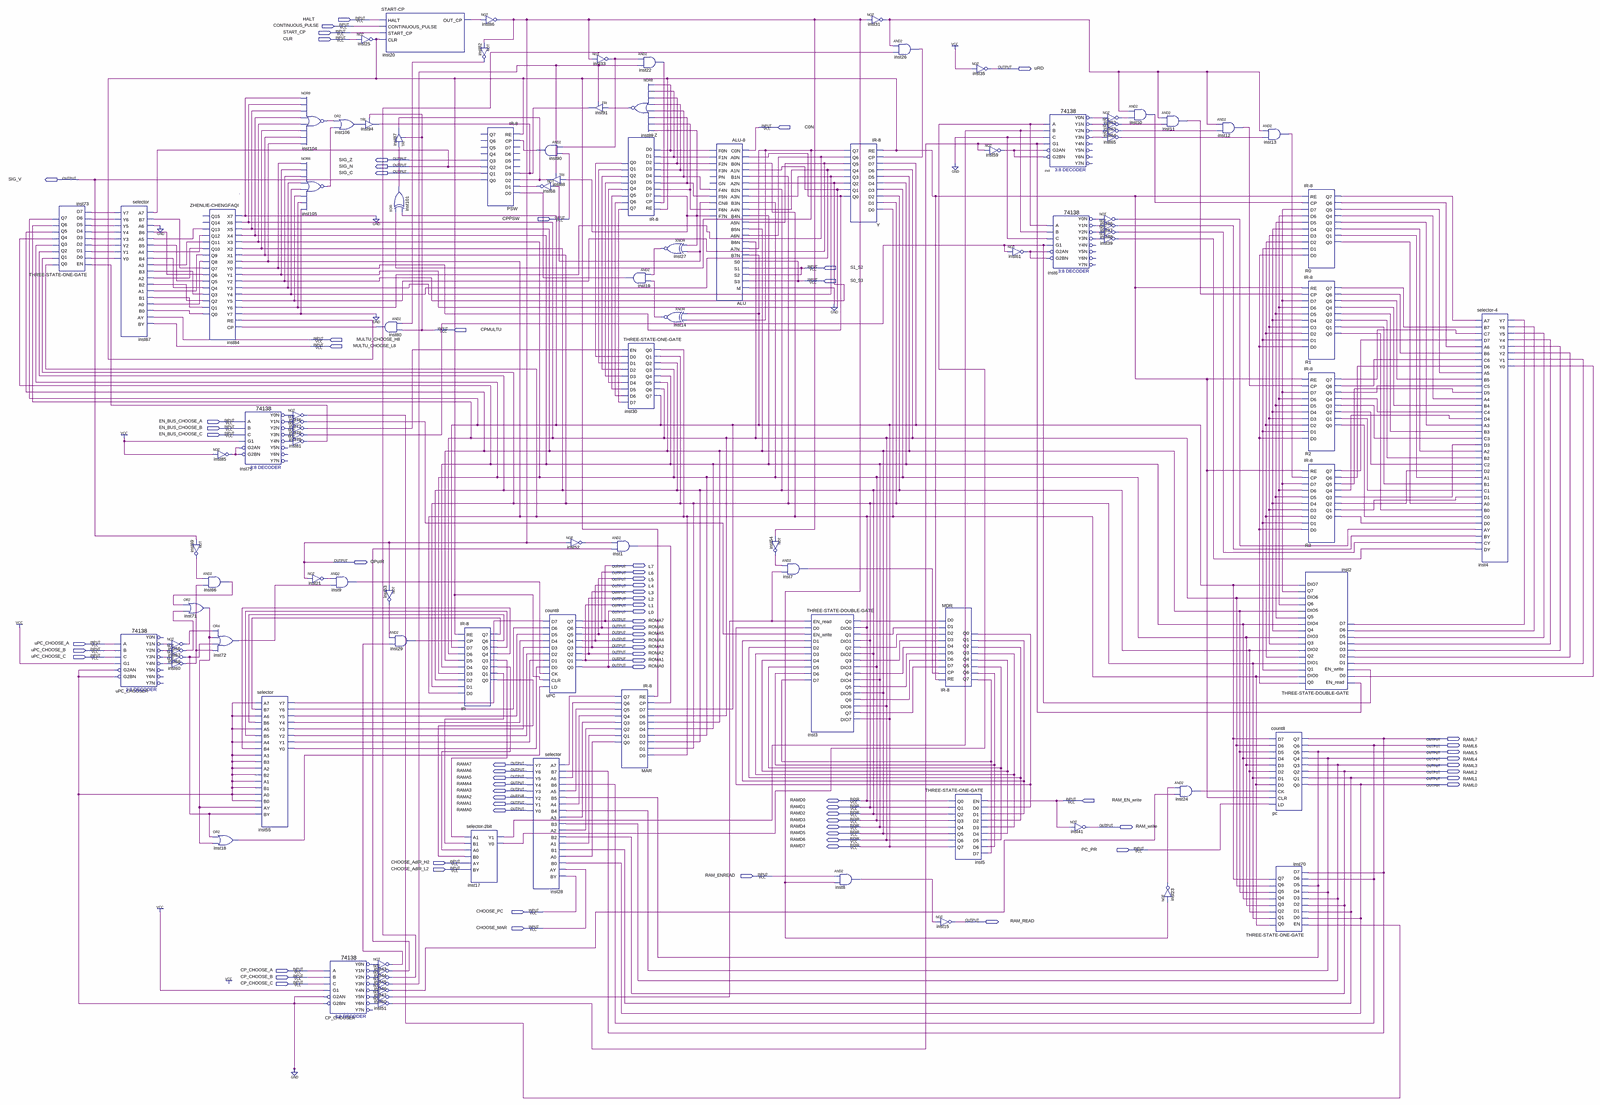
[diagram p0: schematic sheet, whole]
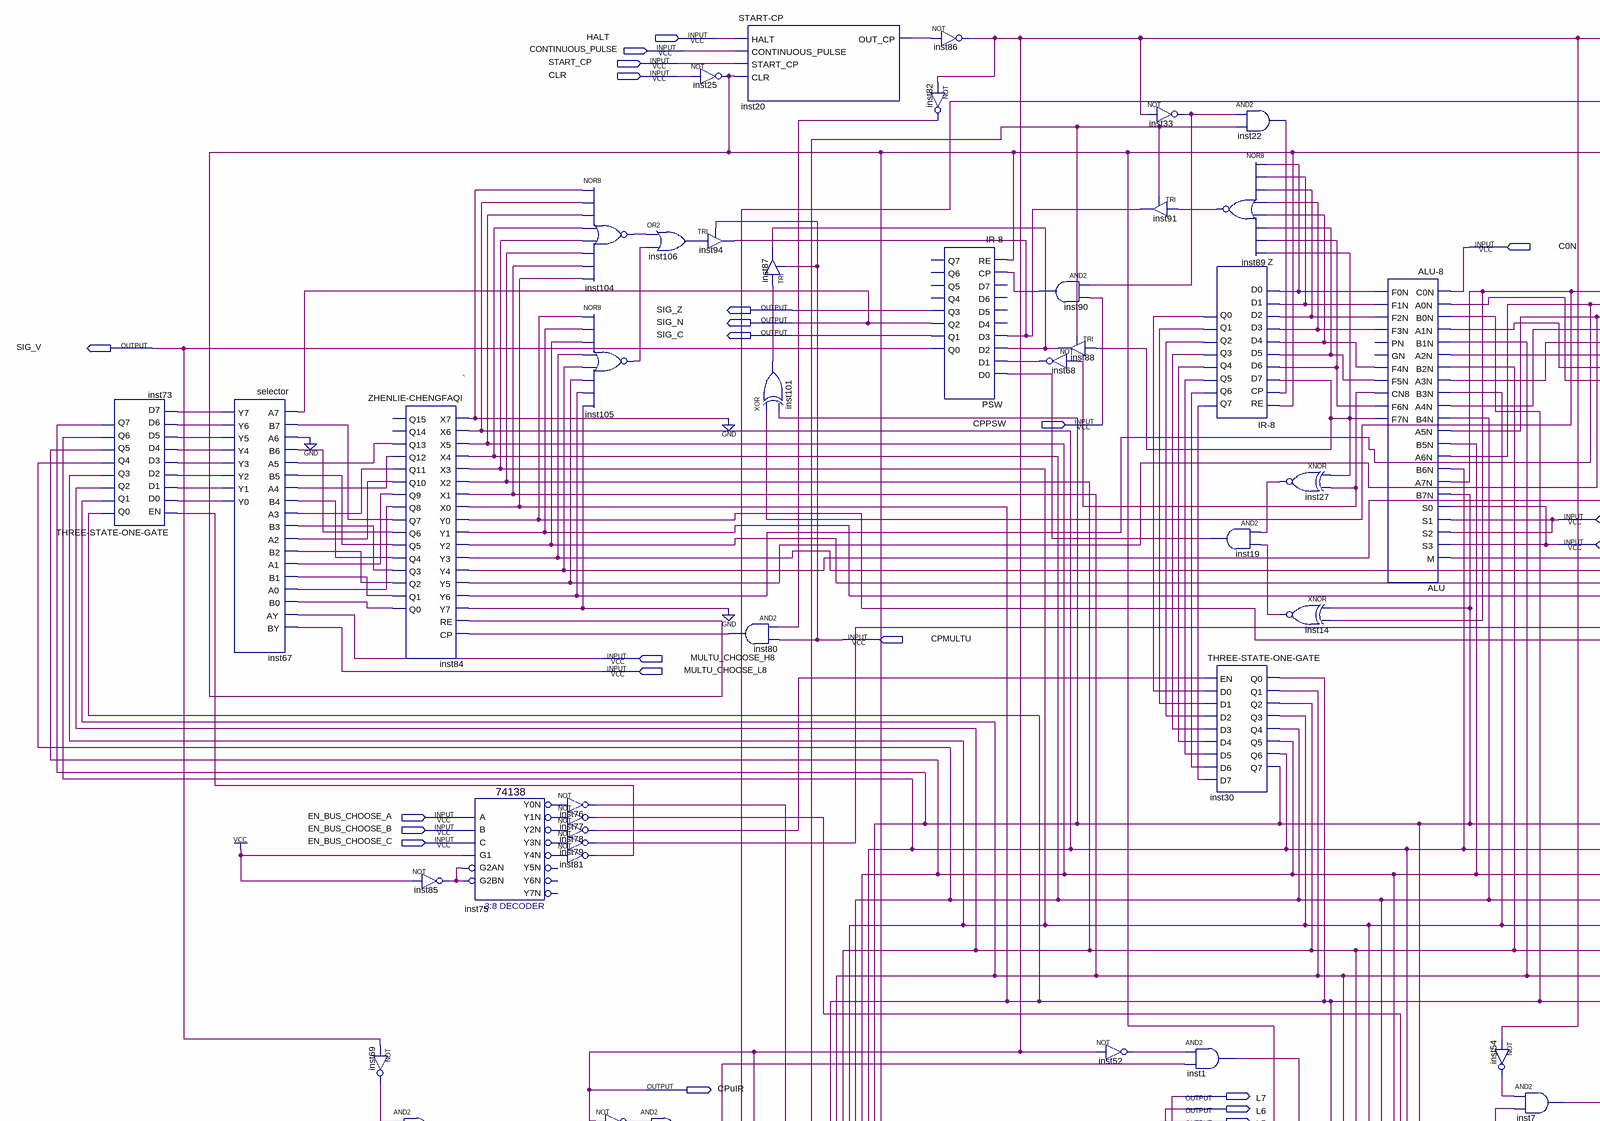
[diagram p1: schematic sheet, upper left part]
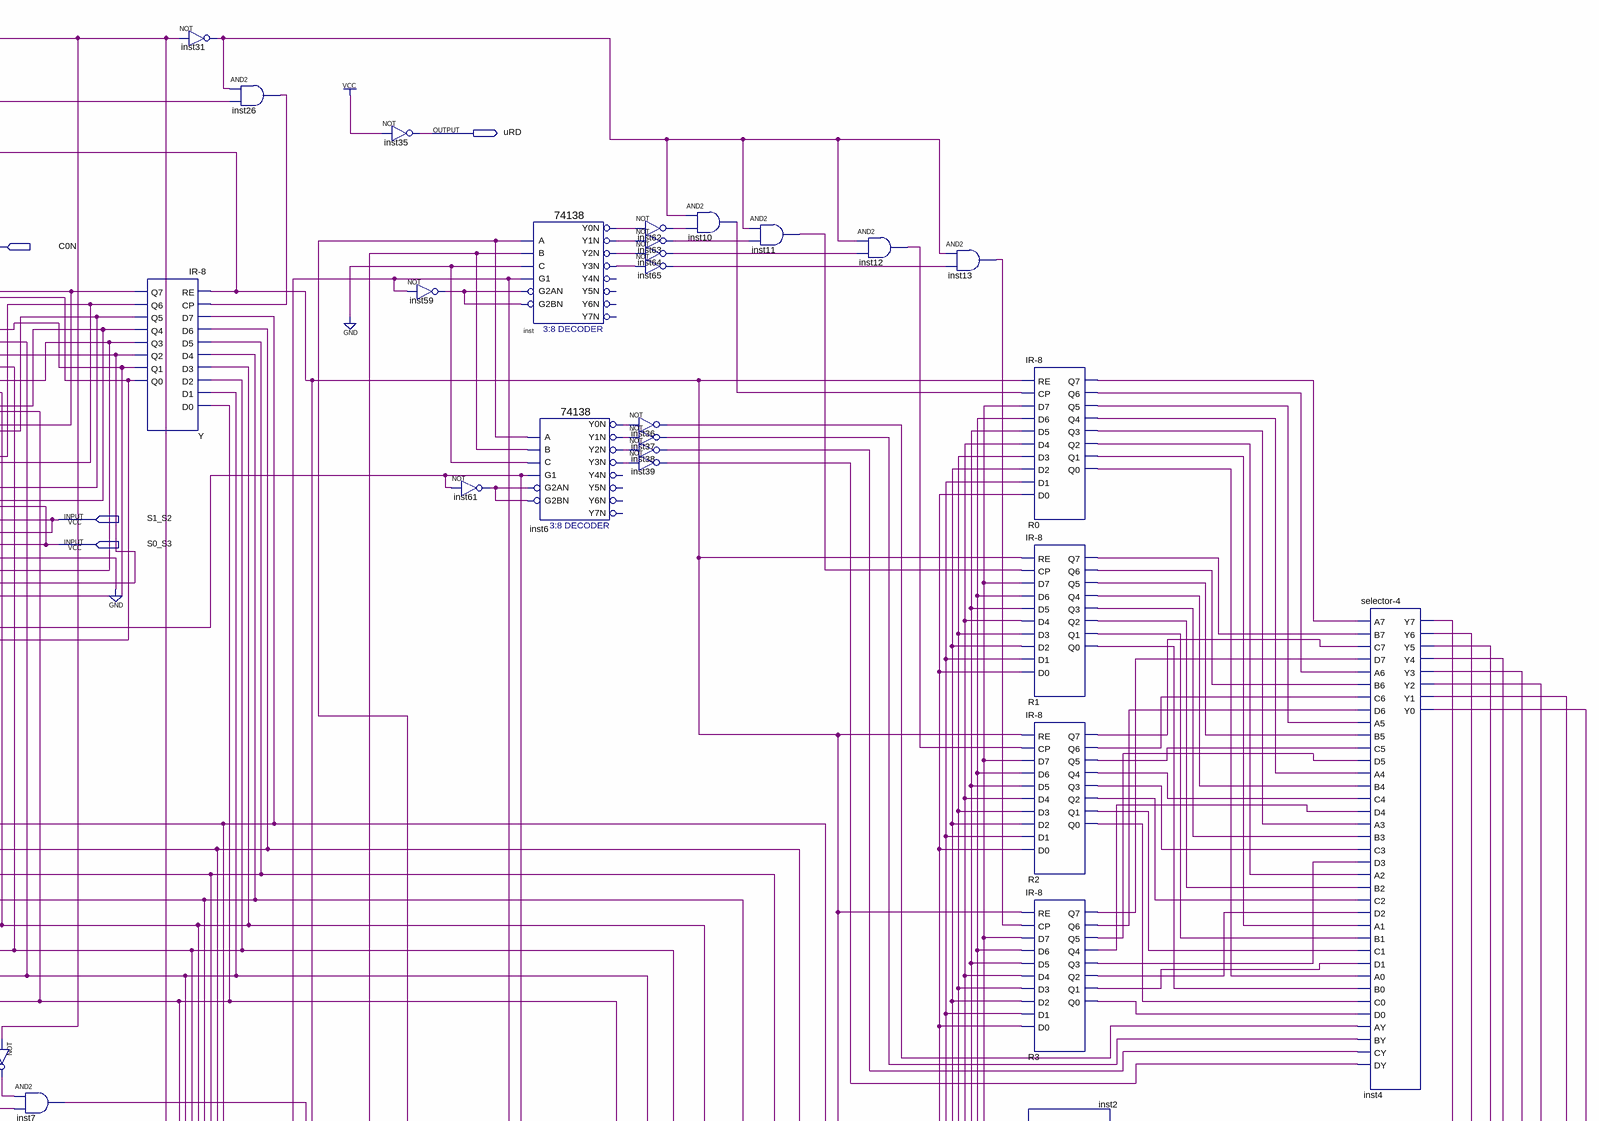
[diagram p2: schematic sheet, upper right part]
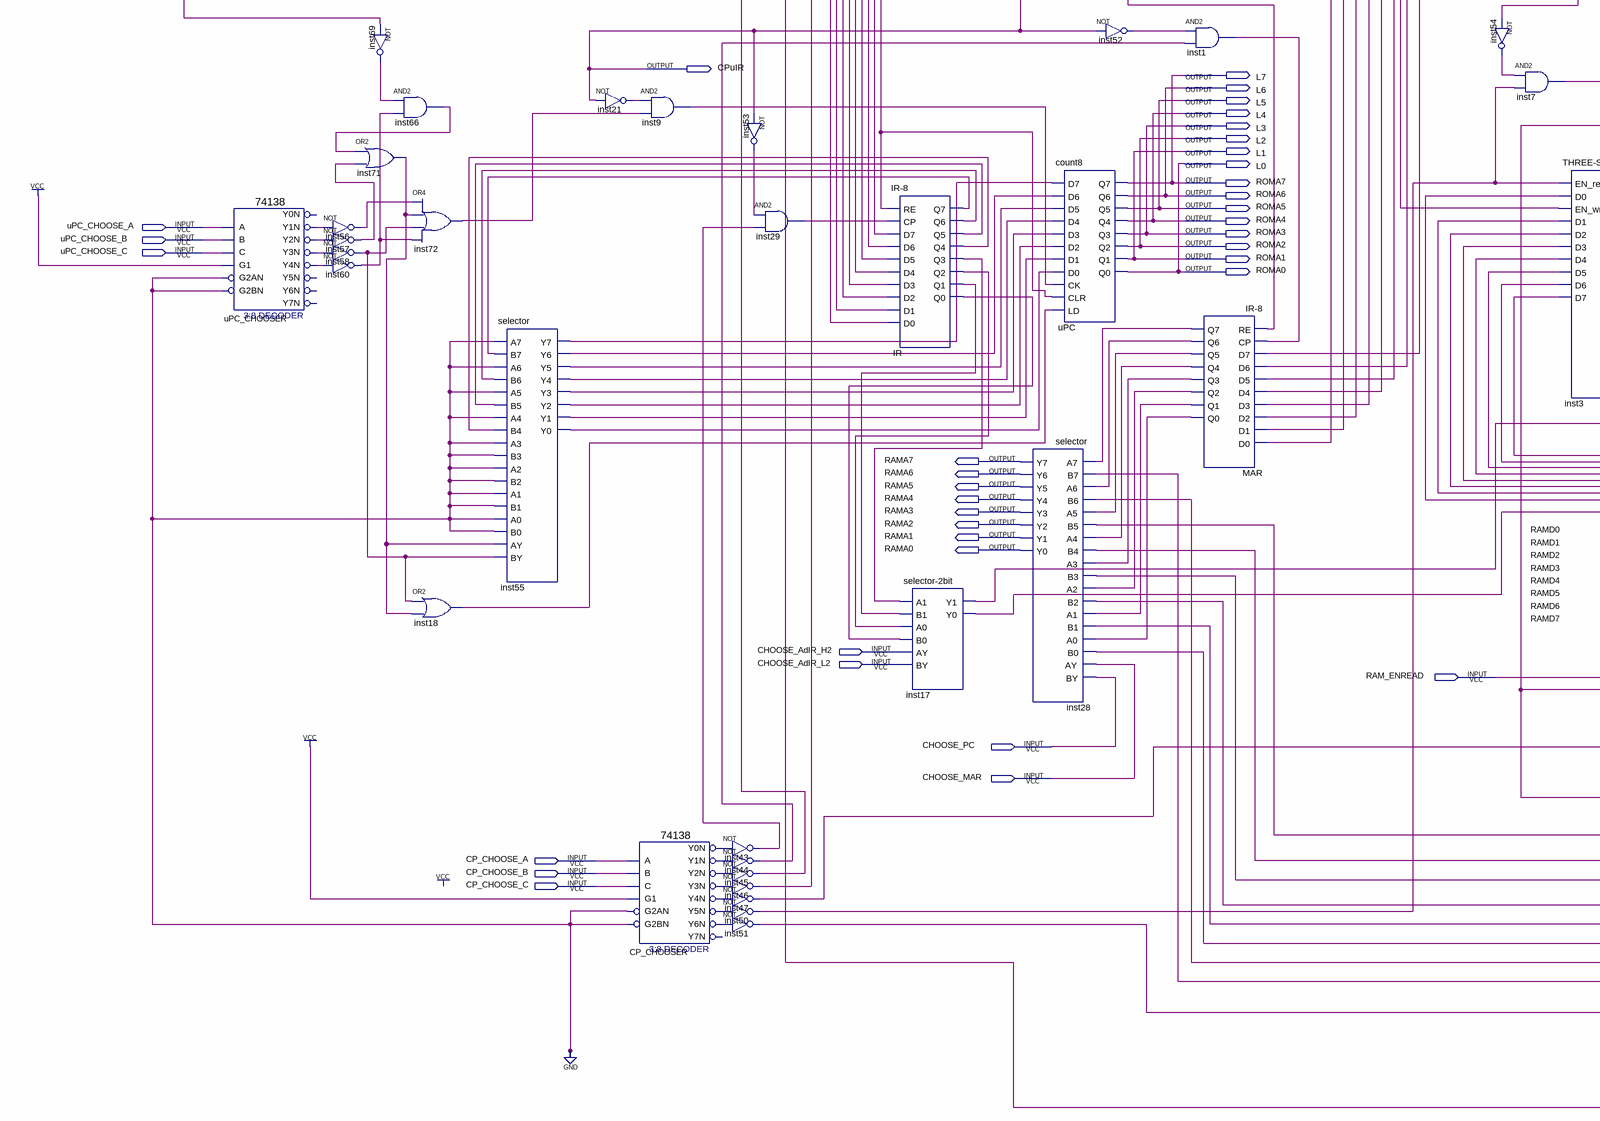
[diagram p3: schematic sheet, lower left part]
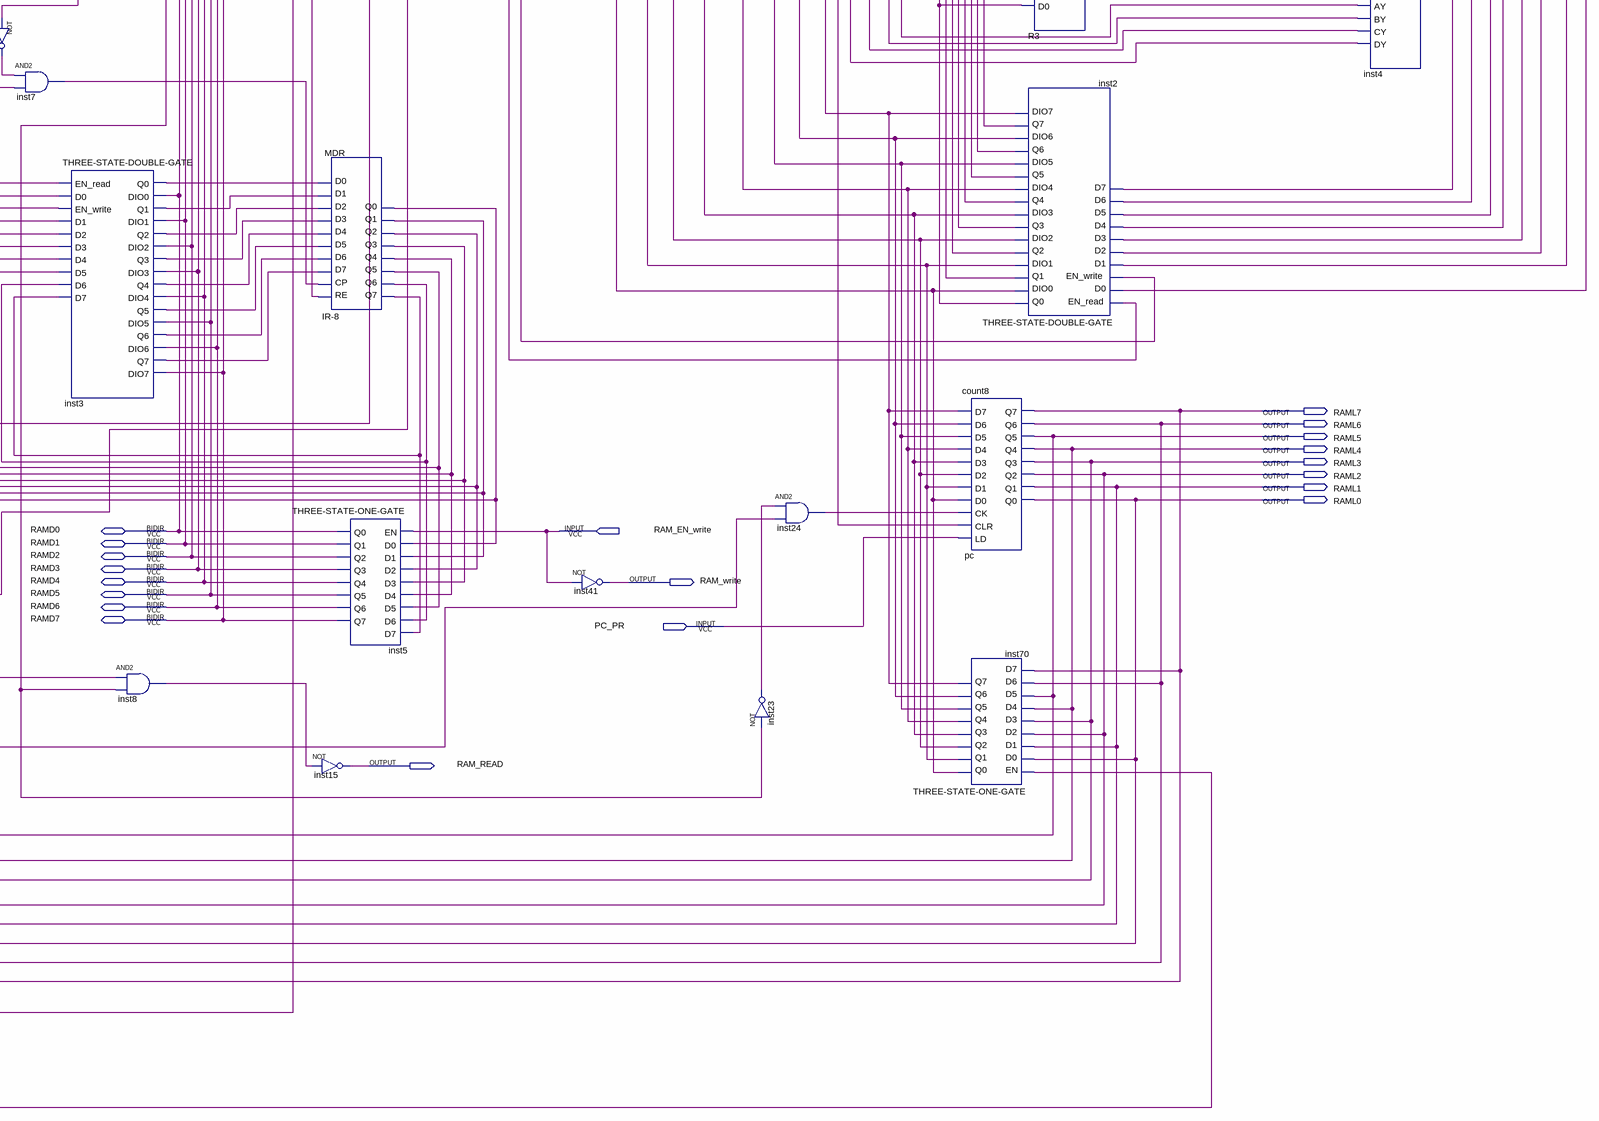
[diagram p4: schematic sheet, lower right part]
// Quartus schematic ModelMachine.bdf as structural Verilog: 103 symbols, 75 pins
module ModelMachine (
  input  HALT,
  input  CONTINUOUS_PULSE,
  input  START_CP,
  input  CLR,
  input  C0N,
  input  CPPSW,
  input  S1_S2,
  input  S0_S3,
  input  CPMULTU,
  input  MULTU_CHOOSE_H8,
  input  MULTU_CHOOSE_L8,
  input  EN_BUS_CHOOSE_A,
  input  EN_BUS_CHOOSE_B,
  input  EN_BUS_CHOOSE_C,
  input  uPC_CHOOSE_A,
  input  uPC_CHOOSE_B,
  input  uPC_CHOOSE_C,
  input  RAM_EN_write,
  input  PC_PR,
  input  CHOOSE_AdIR_H2,
  input  CHOOSE_AdIR_L2,
  input  RAM_ENREAD,
  input  CHOOSE_PC,
  input  CHOOSE_MAR,
  input  CP_CHOOSE_A,
  input  CP_CHOOSE_B,
  input  CP_CHOOSE_C,
  inout  RAMD0,
  inout  RAMD1,
  inout  RAMD2,
  inout  RAMD3,
  inout  RAMD4,
  inout  RAMD5,
  inout  RAMD6,
  inout  RAMD7,
  output uRD,
  output SIG_Z,
  output SIG_N,
  output SIG_C,
  output SIG_V,
  output CPuIR,
  output L7,
  output L6,
  output L5,
  output L4,
  output L3,
  output L2,
  output L1,
  output L0,
  output ROMA7,
  output ROMA6,
  output ROMA5,
  output ROMA4,
  output ROMA3,
  output ROMA2,
  output ROMA1,
  output ROMA0,
  output RAML7,
  output RAML6,
  output RAML5,
  output RAML4,
  output RAMA7,
  output RAML3,
  output RAMA6,
  output RAML2,
  output RAMA5,
  output RAML1,
  output RAMA4,
  output RAML0,
  output RAMA3,
  output RAMA2,
  output RAMA1,
  output RAMA0,
  output RAM_write,
  output RAM_READ
);

  wire ALU_cn8, ALU_f0n, ALU_f1n, ALU_f2n, ALU_f3n, ALU_f4n, ALU_f5n, ALU_f6n, ALU_f7n, CP_CHOOSER_y0n,
       CP_CHOOSER_y1n, CP_CHOOSER_y2n, CP_CHOOSER_y3n, CP_CHOOSER_y4n, CP_CHOOSER_y5n, CP_CHOOSER_y6n,
       inst1_out, inst2_q0, inst2_q1, inst2_q2, inst2_q3, inst2_q4, inst2_q5, inst2_q6, inst2_q7, inst3_q0,
       inst3_q1, inst3_q2, inst3_q3, inst3_q4, inst3_q5, inst3_q6, inst3_q7, inst4_y0, inst4_y1, inst4_y2,
       inst4_y3, inst4_y4, inst4_y5, inst4_y6, inst4_y7, inst6_y0n, inst6_y1n, inst6_y2n, inst6_y3n,
       inst7_out, inst8_out, inst9_out, inst10_out, inst11_out, inst12_out, inst13_out, inst14_out,
       inst17_y0, inst17_y1, inst18_out, inst19_out, inst20_out_cp, inst21_out, inst22_out, inst23_out,
       inst24_out, inst25_out, inst26_out, inst27_out, inst29_out, inst31_out, inst33_out, inst36_out,
       inst37_out, inst38_out, inst39_out, inst43_out, inst44_out, inst45_out, inst46_out, inst47_out,
       inst50_out, inst51_out, inst52_out, inst53_out, inst54_out, inst55_y0, inst55_y1, inst55_y2,
       inst55_y3, inst55_y4, inst55_y5, inst55_y6, inst55_y7, inst56_out, inst57_out, inst58_out, inst59_out,
       inst60_out, inst61_out, inst62_out, inst63_out, inst64_out, inst65_out, inst66_out, inst67_y0,
       inst67_y1, inst67_y2, inst67_y3, inst67_y4, inst67_y5, inst67_y6, inst67_y7, inst68_out, inst69_out,
       inst71_out, inst72_out, inst75_y0n, inst75_y1n, inst75_y2n, inst75_y3n, inst75_y4n, inst76_out,
       inst77_out, inst78_out, inst79_out, inst80_out, inst81_out, inst82_out, inst84_q0, inst84_q1,
       inst84_q2, inst84_q3, inst84_q4, inst84_q5, inst84_q6, inst84_q7, inst84_q8, inst84_q9, inst84_q10,
       inst84_q11, inst84_q12, inst84_q13, inst85_out, inst87_out, inst89_out, inst90_out, inst94_out,
       inst101_out, inst104_out, inst105_out, inst106_out, inst_y0n, inst_y1n, inst_y2n, inst_y3n, IR_q0,
       IR_q1, IR_q2, IR_q3, IR_q4, IR_q5, IR_q6, IR_q7, MAR_q0, MAR_q1, MAR_q2, MAR_q3, MAR_q4, MAR_q5,
       MAR_q6, MAR_q7, MDR_q0, MDR_q1, MDR_q2, MDR_q3, MDR_q4, MDR_q5, MDR_q6, MDR_q7, R0_q0, R0_q1, R0_q2,
       R0_q3, R0_q4, R0_q5, R0_q6, R0_q7, R1_q0, R1_q1, R1_q2, R1_q3, R1_q4, R1_q5, R1_q6, R1_q7, R2_q0,
       R2_q1, R2_q2, R2_q3, R2_q4, R2_q5, R2_q6, R2_q7, R3_q0, R3_q1, R3_q2, R3_q3, R3_q4, R3_q5, R3_q6,
       R3_q7, uPC_CHOOSER_y1n, uPC_CHOOSER_y2n, uPC_CHOOSER_y3n, uPC_CHOOSER_y4n, Y_q0, Y_q1, Y_q2, Y_q3,
       Y_q4, Y_q5, Y_q6, Y_q7, Z_q0, Z_q1, Z_q2, Z_q3, Z_q4, Z_q5, Z_q6, Z_q7;

  \THREE-STATE-ONE-GATE  inst73 (
    .EN(inst81_out), .D0(inst67_y0), .D1(inst67_y1), .D2(inst67_y2), .D3(inst67_y3), .D4(inst67_y4),
    .D5(inst67_y5), .D6(inst67_y6), .D7(inst67_y7), .Q0(RAMD0), .Q1(RAMD1), .Q2(RAMD2), .Q3(RAMD3),
    .Q4(RAMD4), .Q5(RAMD5), .Q6(RAMD6), .Q7(RAMD7));
  selector inst67 (
    .A7(SIG_N), .B7(inst84_q7), .A6(1'b0), .B6(inst84_q6), .A5(inst84_q13), .B5(inst84_q5), .A4(inst84_q12),
    .B4(inst84_q4), .A3(inst84_q11), .B3(inst84_q3), .A2(inst84_q10), .B2(inst84_q2), .A1(inst84_q9),
    .B1(inst84_q1), .A0(inst84_q8), .B0(inst84_q0), .AY(MULTU_CHOOSE_H8), .BY(MULTU_CHOOSE_L8),
    .Y7(inst67_y7), .Y6(inst67_y6), .Y5(inst67_y5), .Y4(inst67_y4), .Y3(inst67_y3), .Y2(inst67_y2),
    .Y1(inst67_y1), .Y0(inst67_y0));
  \74138  uPC_CHOOSER (
    .A(uPC_CHOOSE_A), .B(uPC_CHOOSE_B), .G1(1'b1), .C(uPC_CHOOSE_C), .G2AN(1'b0), .G2BN(1'b0),
    .Y1N(uPC_CHOOSER_y1n), .Y2N(uPC_CHOOSER_y2n), .Y3N(uPC_CHOOSER_y3n), .Y4N(uPC_CHOOSER_y4n));  // open: Y0N, Y5N, Y6N, Y7N
  not inst56 (inst56_out, uPC_CHOOSER_y1n);
  not inst57 (inst57_out, uPC_CHOOSER_y2n);
  not inst58 (inst58_out, uPC_CHOOSER_y3n);
  not inst60 (inst60_out, uPC_CHOOSER_y4n);
  not inst69 (inst69_out, SIG_V);
  or inst71 (inst71_out, inst66_out, inst57_out);
  \ZHENLIE-CHENGFAQI  inst84 (
    .X7(1'b0), .X6(RAMD6), .X5(RAMD5), .X4(RAMD4), .X3(RAMD3), .X2(RAMD2), .X1(RAMD1), .X0(RAMD0), .Y0(Y_q0),
    .Y1(Y_q1), .Y2(Y_q2), .Y3(Y_q3), .Y4(Y_q4), .Y5(Y_q5), .Y6(Y_q6), .Y7(1'b0), .RE(inst25_out),
    .CP(inst80_out), .Q13(inst84_q13), .Q12(inst84_q12), .Q11(inst84_q11), .Q10(inst84_q10), .Q9(inst84_q9),
    .Q8(inst84_q8), .Q7(inst84_q7), .Q6(inst84_q6), .Q5(inst84_q5), .Q4(inst84_q4), .Q3(inst84_q3),
    .Q2(inst84_q2), .Q1(inst84_q1), .Q0(inst84_q0));  // open: Q15, Q14
  not inst85 (inst85_out, 1'b1);
  and inst66 (inst66_out, inst69_out, inst60_out);
  or inst72 (inst72_out, inst56_out, inst71_out, inst58_out, inst60_out);
  or inst18 (inst18_out, inst58_out, inst71_out);
  \74138  inst75 (
    .A(EN_BUS_CHOOSE_A), .B(EN_BUS_CHOOSE_B), .G1(1'b1), .C(EN_BUS_CHOOSE_C), .G2AN(inst85_out),
    .G2BN(inst85_out), .Y0N(inst75_y0n), .Y1N(inst75_y1n), .Y2N(inst75_y2n), .Y3N(inst75_y3n),
    .Y4N(inst75_y4n));  // open: Y5N, Y6N, Y7N
  selector inst55 (
    .A7(1'b0), .B7(IR_q7), .A6(1'b0), .B6(IR_q6), .A5(1'b0), .B5(IR_q5), .A4(1'b0), .B4(IR_q4), .A3(1'b0),
    .B3(1'b0), .A2(1'b0), .B2(1'b0), .A1(1'b0), .B1(1'b0), .A0(1'b0), .B0(1'b0), .AY(inst71_out),
    .BY(inst58_out), .Y7(inst55_y7), .Y6(inst55_y6), .Y5(inst55_y5), .Y4(inst55_y4), .Y3(inst55_y3),
    .Y2(inst55_y2), .Y1(inst55_y1), .Y0(inst55_y0));
  nor inst104 (inst104_out, 1'b0, RAMD6, RAMD5, RAMD4, RAMD3, RAMD2, RAMD1, RAMD0);
  nor inst105 (inst105_out, Y_q0, Y_q1, Y_q2, Y_q3, Y_q4, Y_q5, Y_q6, 1'b0);
  not inst76 (inst76_out, inst75_y0n);
  not inst77 (inst77_out, inst75_y1n);
  not inst78 (inst78_out, inst75_y2n);
  not inst79 (inst79_out, inst75_y3n);
  not inst81 (inst81_out, inst75_y4n);
  and inst9 (inst9_out, inst21_out, inst72_out);
  not inst21 (inst21_out, CPuIR);
  \74138  CP_CHOOSER (
    .A(CP_CHOOSE_A), .B(CP_CHOOSE_B), .G1(1'b1), .C(CP_CHOOSE_C), .G2AN(1'b0), .G2BN(1'b0),
    .Y0N(CP_CHOOSER_y0n), .Y1N(CP_CHOOSER_y1n), .Y2N(CP_CHOOSER_y2n), .Y3N(CP_CHOOSER_y3n),
    .Y4N(CP_CHOOSER_y4n), .Y5N(CP_CHOOSER_y5n), .Y6N(CP_CHOOSER_y6n));  // open: Y7N
  not inst25 (inst25_out, CLR);
  or inst106 (inst106_out, inst104_out, inst105_out);
  \START-CP  inst20 (
    .HALT(HALT), .CONTINUOUS_PULSE(CONTINUOUS_PULSE), .START_CP(START_CP), .CLR(inst25_out),
    .OUT_CP(inst20_out_cp));
  TRI inst94 (.IN(inst106_out), .OE(CPMULTU), .OUT(inst94_out));
  and inst80 (inst80_out, inst82_out, CPMULTU);
  not inst53 (inst53_out, CPuIR);
  not inst43 (inst43_out, CP_CHOOSER_y0n);
  not inst44 (inst44_out, CP_CHOOSER_y1n);
  not inst45 (inst45_out, CP_CHOOSER_y2n);
  not inst46 (inst46_out, CP_CHOOSER_y3n);
  not inst47 (inst47_out, CP_CHOOSER_y4n);
  not inst50 (inst50_out, CP_CHOOSER_y5n);
  not inst51 (inst51_out, CP_CHOOSER_y6n);
  TRI inst87 (.IN(inst101_out), .OE(CPMULTU), .OUT(inst87_out));
  xor inst101 (inst101_out, Y_q7, RAMD7);
  and inst29 (inst29_out, inst53_out, inst43_out);
  \IR-8  IR (
    .RE(inst25_out), .CP(inst29_out), .D7(RAMD7), .D6(RAMD6), .D5(RAMD5), .D4(RAMD4), .D3(RAMD3), .D2(RAMD2),
    .D1(RAMD1), .D0(RAMD0), .Q7(IR_q7), .Q6(IR_q6), .Q5(IR_q5), .Q4(IR_q4), .Q3(IR_q3), .Q2(IR_q2),
    .Q1(IR_q1), .Q0(IR_q0));
  not inst86 (CPuIR, inst20_out_cp);
  not inst82 (inst82_out, CPuIR);
  \IR-8  PSW (
    .RE(inst25_out), .CP(inst90_out), .D3(inst94_out), .D2(inst87_out), .D1(inst68_out), .D0(inst19_out),
    .Q3(SIG_Z), .Q2(SIG_N), .Q1(SIG_C), .Q0(SIG_V));  // open: D7, D6, D5, D4, Q7, Q6, Q5, Q4
  \selector-2bit  inst17 (
    .A1(IR_q3), .B1(IR_q1), .A0(IR_q2), .B0(IR_q0), .AY(CHOOSE_AdIR_H2), .BY(CHOOSE_AdIR_L2), .Y1(inst17_y1),
    .Y0(inst17_y0));
  and inst90 (inst90_out, inst33_out, CPPSW);
  not inst68 (inst68_out, ALU_cn8);
  selector inst28 (
    .A7(MAR_q7), .B7(RAML7), .A6(MAR_q6), .B6(RAML6), .A5(MAR_q5), .B5(RAML5), .A4(MAR_q4), .B4(RAML4),
    .A3(MAR_q3), .B3(RAML3), .A2(MAR_q2), .B2(RAML2), .A1(MAR_q1), .B1(RAML1), .A0(MAR_q0), .B0(RAML0),
    .AY(CHOOSE_MAR), .BY(CHOOSE_PC), .Y7(RAMA7), .Y6(RAMA6), .Y5(RAMA5), .Y4(RAMA4), .Y3(RAMA3), .Y2(RAMA2),
    .Y1(RAMA1), .Y0(RAMA0));
  TRI inst88 (.IN(ALU_f7n), .OE(inst46_out), .OUT(inst87_out));
  not inst52 (inst52_out, CPuIR);
  count8 uPC (
    .D7(inst55_y7), .D6(inst55_y6), .D5(inst55_y5), .D4(inst55_y4), .D3(inst55_y3), .D2(inst55_y2),
    .D1(inst55_y1), .D0(inst55_y0), .CK(inst9_out), .CLR(inst25_out), .LD(inst18_out), .Q7(L7), .Q6(L6),
    .Q5(L5), .Q4(L4), .Q3(L3), .Q2(L2), .Q1(L1), .Q0(L0));
  not inst33 (inst33_out, CPuIR);
  TRI inst91 (.IN(inst89_out), .OE(inst46_out), .OUT(inst94_out));
  and inst1 (inst1_out, inst52_out, inst44_out);
  \IR-8  MAR (
    .RE(inst25_out), .CP(inst1_out), .D7(RAMD7), .D6(RAMD6), .D5(RAMD5), .D4(RAMD4), .D3(RAMD3), .D2(RAMD2),
    .D1(RAMD1), .D0(RAMD0), .Q7(MAR_q7), .Q6(MAR_q6), .Q5(MAR_q5), .Q4(MAR_q4), .Q3(MAR_q3), .Q2(MAR_q2),
    .Q1(MAR_q1), .Q0(MAR_q0));
  and inst22 (inst22_out, inst33_out, inst46_out);
  nor inst89 (inst89_out, ALU_f0n, ALU_f1n, ALU_f2n, ALU_f3n, ALU_f4n, ALU_f5n, ALU_f6n, ALU_f7n);
  \IR-8  Z (
    .RE(inst25_out), .CP(inst22_out), .D7(ALU_f7n), .D6(ALU_f6n), .D5(ALU_f5n), .D4(ALU_f4n), .D3(ALU_f3n),
    .D2(ALU_f2n), .D1(ALU_f1n), .D0(ALU_f0n), .Q7(Z_q7), .Q6(Z_q6), .Q5(Z_q5), .Q4(Z_q4), .Q3(Z_q3),
    .Q2(Z_q2), .Q1(Z_q1), .Q0(Z_q0));
  and inst19 (inst19_out, inst27_out, inst14_out);
  \THREE-STATE-ONE-GATE  inst30 (
    .EN(inst78_out), .D0(Z_q0), .D1(Z_q1), .D2(Z_q2), .D3(Z_q3), .D4(Z_q4), .D5(Z_q5), .D6(Z_q6), .D7(Z_q7),
    .Q0(RAMD0), .Q1(RAMD1), .Q2(RAMD2), .Q3(RAMD3), .Q4(RAMD4), .Q5(RAMD5), .Q6(RAMD6), .Q7(RAMD7));
  xnor inst27 (inst27_out, ALU_f7n, ALU_cn8);
  xnor inst14 (inst14_out, RAMD7, Y_q7);
  \ALU-8  ALU (
    .C0N(C0N), .A0N(Y_q0), .B0N(RAMD0), .A1N(Y_q1), .B1N(RAMD1), .A2N(Y_q2), .B2N(RAMD2), .A3N(Y_q3),
    .B3N(RAMD3), .A4N(Y_q4), .B4N(RAMD4), .A5N(Y_q5), .B5N(RAMD5), .A6N(Y_q6), .B6N(RAMD6), .A7N(Y_q7),
    .B7N(RAMD7), .S0(S0_S3), .S1(S1_S2), .S2(S1_S2), .S3(S0_S3), .M(1'b0), .F0N(ALU_f0n), .F1N(ALU_f1n),
    .F2N(ALU_f2n), .F3N(ALU_f3n), .F4N(ALU_f4n), .F5N(ALU_f5n), .CN8(ALU_cn8), .F6N(ALU_f6n), .F7N(ALU_f7n));  // open: PN, GN
  not inst54 (inst54_out, CPuIR);
  and inst7 (inst7_out, inst54_out, inst50_out);
  \THREE-STATE-DOUBLE-GATE  inst3 (
    .EN_read(inst50_out), .D0(MDR_q0), .EN_write(inst77_out), .D1(MDR_q1), .D2(MDR_q2), .D3(MDR_q3),
    .D4(MDR_q4), .D5(MDR_q5), .D6(MDR_q6), .D7(MDR_q7), .Q0(inst3_q0), .Q1(inst3_q1), .Q2(inst3_q2),
    .Q3(inst3_q3), .Q4(inst3_q4), .Q5(inst3_q5), .Q6(inst3_q6), .Q7(inst3_q7), .DIO0(RAMD0), .DIO1(RAMD1),
    .DIO2(RAMD2), .DIO3(RAMD3), .DIO4(RAMD4), .DIO5(RAMD5), .DIO6(RAMD6), .DIO7(RAMD7));
  \IR-8  Y (
    .RE(inst25_out), .CP(inst26_out), .D7(RAMD7), .D6(RAMD6), .D5(RAMD5), .D4(RAMD4), .D3(RAMD3), .D2(RAMD2),
    .D1(RAMD1), .D0(RAMD0), .Q7(Y_q7), .Q6(Y_q6), .Q5(Y_q5), .Q4(Y_q4), .Q3(Y_q3), .Q2(Y_q2), .Q1(Y_q1),
    .Q0(Y_q0));
  and inst8 (inst8_out, RAM_ENREAD, CPuIR);
  not inst31 (inst31_out, CPuIR);
  and inst26 (inst26_out, inst31_out, inst45_out);
  \IR-8  MDR (
    .RE(inst25_out), .CP(inst7_out), .D7(inst3_q7), .D6(inst3_q6), .D5(inst3_q5), .D4(inst3_q4),
    .D3(inst3_q3), .D2(inst3_q2), .D1(inst3_q1), .D0(inst3_q0), .Q7(MDR_q7), .Q6(MDR_q6), .Q5(MDR_q5),
    .Q4(MDR_q4), .Q3(MDR_q3), .Q2(MDR_q2), .Q1(MDR_q1), .Q0(MDR_q0));
  \THREE-STATE-ONE-GATE  inst5 (
    .EN(RAM_EN_write), .D0(MDR_q0), .D1(MDR_q1), .D2(MDR_q2), .D3(MDR_q3), .D4(MDR_q4), .D5(MDR_q5),
    .D6(MDR_q6), .D7(MDR_q7), .Q0(RAMD0), .Q1(RAMD1), .Q2(RAMD2), .Q3(RAMD3), .Q4(RAMD4), .Q5(RAMD5),
    .Q6(RAMD6), .Q7(RAMD7));
  not inst15 (RAM_READ, inst8_out);
  not inst35 (uRD, 1'b1);
  not inst59 (inst59_out, inst51_out);
  not inst61 (inst61_out, inst79_out);
  \74138  inst (
    .A(inst17_y0), .B(inst17_y1), .G1(inst51_out), .C(1'b0), .G2AN(inst59_out), .G2BN(inst59_out),
    .Y0N(inst_y0n), .Y1N(inst_y1n), .Y2N(inst_y2n), .Y3N(inst_y3n));  // open: Y4N, Y5N, Y6N, Y7N
  \74138  inst6 (
    .A(inst17_y0), .B(inst17_y1), .G1(inst79_out), .C(1'b0), .G2AN(inst61_out), .G2BN(inst61_out),
    .Y0N(inst6_y0n), .Y1N(inst6_y1n), .Y2N(inst6_y2n), .Y3N(inst6_y3n));  // open: Y4N, Y5N, Y6N, Y7N
  not inst41 (RAM_write, RAM_EN_write);
  not inst62 (inst62_out, inst_y0n);
  not inst63 (inst63_out, inst_y1n);
  not inst64 (inst64_out, inst_y2n);
  not inst65 (inst65_out, inst_y3n);
  not inst36 (inst36_out, inst6_y0n);
  not inst37 (inst37_out, inst6_y1n);
  not inst38 (inst38_out, inst6_y2n);
  not inst39 (inst39_out, inst6_y3n);
  and inst10 (inst10_out, inst31_out, inst62_out);
  and inst11 (inst11_out, inst31_out, inst63_out);
  not inst23 (inst23_out, CPuIR);
  and inst24 (inst24_out, inst23_out, inst47_out);
  and inst12 (inst12_out, inst31_out, inst64_out);
  and inst13 (inst13_out, inst31_out, inst65_out);
  count8 pc (
    .D7(RAMD7), .D6(RAMD6), .D5(RAMD5), .D4(RAMD4), .D3(RAMD3), .D2(RAMD2), .D1(RAMD1), .D0(RAMD0),
    .CK(inst24_out), .CLR(inst25_out), .LD(PC_PR), .Q7(RAML7), .Q6(RAML6), .Q5(RAML5), .Q4(RAML4),
    .Q3(RAML3), .Q2(RAML2), .Q1(RAML1), .Q0(RAML0));
  \THREE-STATE-ONE-GATE  inst70 (
    .EN(inst76_out), .D0(RAML0), .D1(RAML1), .D2(RAML2), .D3(RAML3), .D4(RAML4), .D5(RAML5), .D6(RAML6),
    .D7(RAML7), .Q0(RAMD0), .Q1(RAMD1), .Q2(RAMD2), .Q3(RAMD3), .Q4(RAMD4), .Q5(RAMD5), .Q6(RAMD6), .Q7(RAMD7));
  \THREE-STATE-DOUBLE-GATE  inst2 (
    .EN_read(inst51_out), .D0(inst4_y0), .EN_write(inst79_out), .D1(inst4_y1), .D2(inst4_y2), .D3(inst4_y3),
    .D4(inst4_y4), .D5(inst4_y5), .D6(inst4_y6), .D7(inst4_y7), .Q0(inst2_q0), .Q1(inst2_q1), .Q2(inst2_q2),
    .Q3(inst2_q3), .Q4(inst2_q4), .Q5(inst2_q5), .Q6(inst2_q6), .Q7(inst2_q7), .DIO0(RAMD0), .DIO1(RAMD1),
    .DIO2(RAMD2), .DIO3(RAMD3), .DIO4(RAMD4), .DIO5(RAMD5), .DIO6(RAMD6), .DIO7(RAMD7));
  \IR-8  R0 (
    .RE(inst25_out), .CP(inst10_out), .D7(inst2_q7), .D6(inst2_q6), .D5(inst2_q5), .D4(inst2_q4),
    .D3(inst2_q3), .D2(inst2_q2), .D1(inst2_q1), .D0(inst2_q0), .Q7(R0_q7), .Q6(R0_q6), .Q5(R0_q5),
    .Q4(R0_q4), .Q3(R0_q3), .Q2(R0_q2), .Q1(R0_q1), .Q0(R0_q0));
  \IR-8  R1 (
    .RE(inst25_out), .CP(inst11_out), .D7(inst2_q7), .D6(inst2_q6), .D5(inst2_q5), .D4(inst2_q4),
    .D3(inst2_q3), .D2(inst2_q2), .D1(inst2_q1), .D0(inst2_q0), .Q7(R1_q7), .Q6(R1_q6), .Q5(R1_q5),
    .Q4(R1_q4), .Q3(R1_q3), .Q2(R1_q2), .Q1(R1_q1), .Q0(R1_q0));
  \IR-8  R2 (
    .RE(inst25_out), .CP(inst12_out), .D7(inst2_q7), .D6(inst2_q6), .D5(inst2_q5), .D4(inst2_q4),
    .D3(inst2_q3), .D2(inst2_q2), .D1(inst2_q1), .D0(inst2_q0), .Q7(R2_q7), .Q6(R2_q6), .Q5(R2_q5),
    .Q4(R2_q4), .Q3(R2_q3), .Q2(R2_q2), .Q1(R2_q1), .Q0(R2_q0));
  \IR-8  R3 (
    .RE(inst25_out), .CP(inst13_out), .D7(inst2_q7), .D6(inst2_q6), .D5(inst2_q5), .D4(inst2_q4),
    .D3(inst2_q3), .D2(inst2_q2), .D1(inst2_q1), .D0(inst2_q0), .Q7(R3_q7), .Q6(R3_q6), .Q5(R3_q5),
    .Q4(R3_q4), .Q3(R3_q3), .Q2(R3_q2), .Q1(R3_q1), .Q0(R3_q0));
  \selector-4  inst4 (
    .A7(R0_q7), .B7(R1_q7), .C7(R2_q7), .D7(R3_q7), .A6(R0_q6), .B6(R1_q6), .C6(R2_q6), .D6(R3_q6),
    .A5(R0_q5), .B5(R1_q5), .C5(R2_q5), .D5(R3_q5), .A4(R0_q4), .B4(R1_q4), .C4(R2_q4), .D4(R3_q4),
    .A3(R0_q3), .B3(R1_q3), .C3(R2_q3), .D3(R3_q3), .A2(R0_q2), .B2(R1_q2), .C2(R2_q2), .D2(R3_q2),
    .A1(R0_q1), .B1(R1_q1), .C1(R2_q1), .D1(R3_q1), .A0(R0_q0), .B0(R1_q0), .C0(R2_q0), .D0(R3_q0),
    .AY(inst36_out), .BY(inst37_out), .CY(inst38_out), .DY(inst39_out), .Y7(inst4_y7), .Y6(inst4_y6),
    .Y5(inst4_y5), .Y4(inst4_y4), .Y3(inst4_y3), .Y2(inst4_y2), .Y1(inst4_y1), .Y0(inst4_y0));

  assign ROMA0 = L0;
  assign ROMA1 = L1;
  assign ROMA2 = L2;
  assign ROMA3 = L3;
  assign ROMA4 = L4;
  assign ROMA5 = L5;
  assign ROMA6 = L6;
  assign ROMA7 = L7;

  // Notes on the sheet:
  //   `
endmodule
